# Altium schematic sheet Sensors1-10.SchDoc
size A
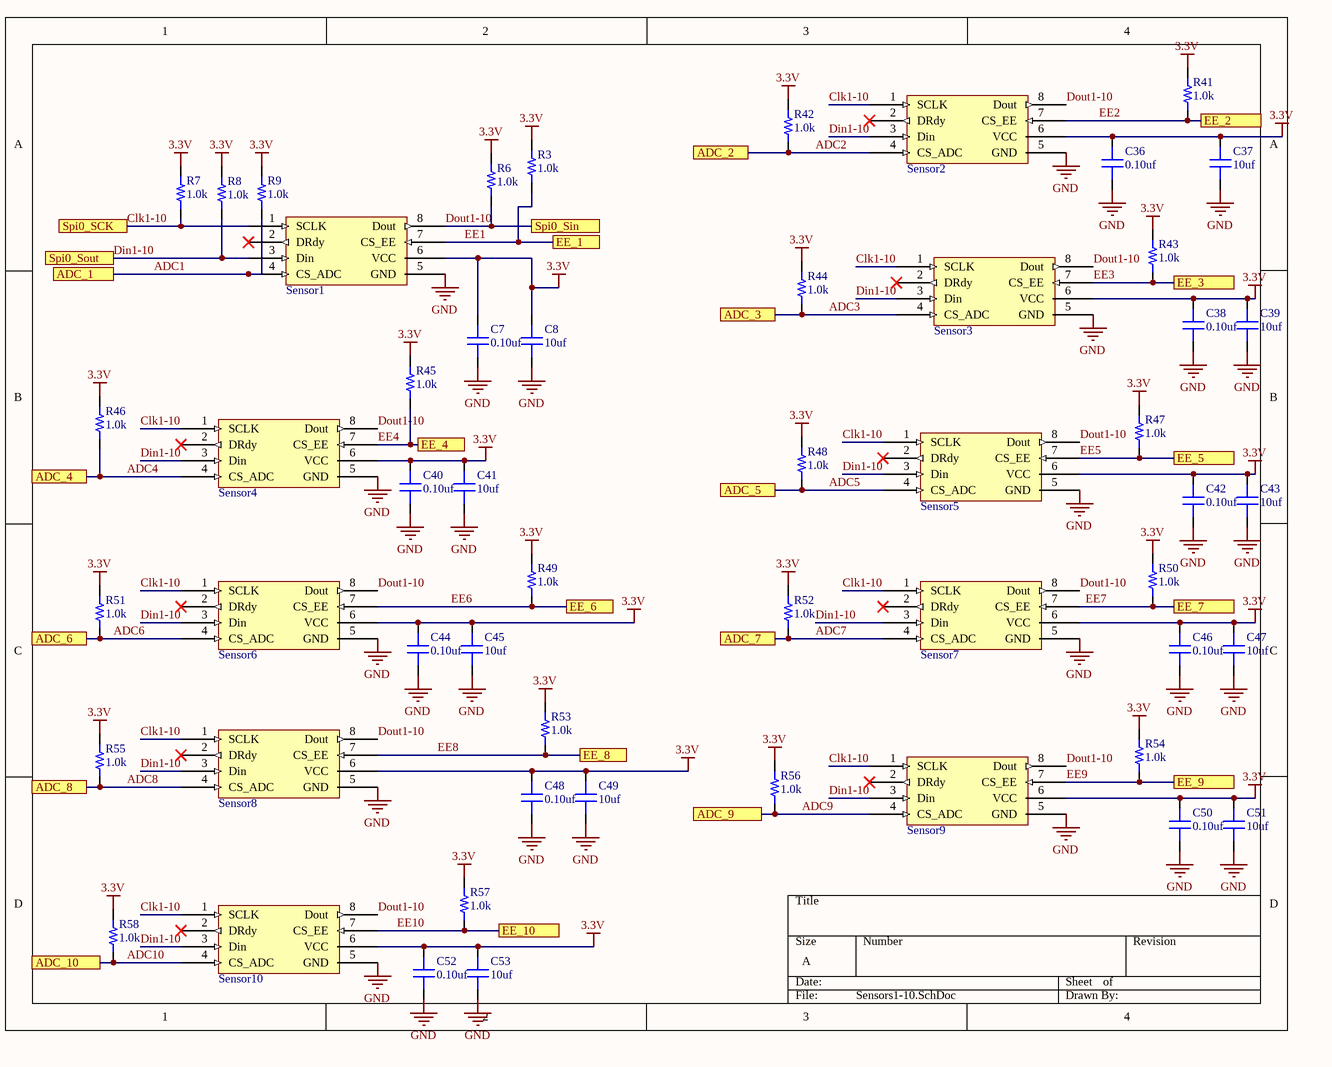
[diagram p0: Sensors1-10.SchDoc]

## Parts
C7  value 0.10uf  [CAP 0603/1608]  (hidden comment: Capacitor MLCC 0.10uf 16V CAP 0603/1608)
C8  value 10uf  [CAP 0603/1608]  (hidden comment: Capacitor MLCC 10uf 16V CAP 0603/1608)
C36  value 0.10uf  [CAP 0603/1608]  (hidden comment: Capacitor MLCC 0.10uf 16V CAP 0603/1608)
C37  value 10uf  [CAP 0603/1608]  (hidden comment: Capacitor MLCC 10uf 16V CAP 0603/1608)
C38  value 0.10uf  [CAP 0603/1608]  (hidden comment: Capacitor MLCC 0.10uf 16V CAP 0603/1608)
C39  value 10uf  [CAP 0603/1608]  (hidden comment: Capacitor MLCC 10uf 16V CAP 0603/1608)
C40  value 0.10uf  [CAP 0603/1608]  (hidden comment: Capacitor MLCC 0.10uf 16V CAP 0603/1608)
C41  value 10uf  [CAP 0603/1608]  (hidden comment: Capacitor MLCC 10uf 16V CAP 0603/1608)
C42  value 0.10uf  [CAP 0603/1608]  (hidden comment: Capacitor MLCC 0.10uf 16V CAP 0603/1608)
C43  value 10uf  [CAP 0603/1608]  (hidden comment: Capacitor MLCC 10uf 16V CAP 0603/1608)
C44  value 0.10uf  [CAP 0603/1608]  (hidden comment: Capacitor MLCC 0.10uf 16V CAP 0603/1608)
C45  value 10uf  [CAP 0603/1608]  (hidden comment: Capacitor MLCC 10uf 16V CAP 0603/1608)
C46  value 0.10uf  [CAP 0603/1608]  (hidden comment: Capacitor MLCC 0.10uf 16V CAP 0603/1608)
C47  value 10uf  [CAP 0603/1608]  (hidden comment: Capacitor MLCC 10uf 16V CAP 0603/1608)
C48  value 0.10uf  [CAP 0603/1608]  (hidden comment: Capacitor MLCC 0.10uf 16V CAP 0603/1608)
C49  value 10uf  [CAP 0603/1608]  (hidden comment: Capacitor MLCC 10uf 16V CAP 0603/1608)
C50  value 0.10uf  [CAP 0603/1608]  (hidden comment: Capacitor MLCC 0.10uf 16V CAP 0603/1608)
C51  value 10uf  [CAP 0603/1608]  (hidden comment: Capacitor MLCC 10uf 16V CAP 0603/1608)
C52  value 0.10uf  [CAP 0603/1608]  (hidden comment: Capacitor MLCC 0.10uf 16V CAP 0603/1608)
C53  value 10uf  [CAP 0603/1608]  (hidden comment: Capacitor MLCC 10uf 16V CAP 0603/1608)
R3  value 1.0k  [RES 0603/1608]  (hidden comment: Resistor 1.0k 0603 1/10W 5%)
R6  value 1.0k  [RES 0603/1608]  (hidden comment: Resistor 1.0k 0603 1/10W 5%)
R7  value 1.0k  [RES 0603/1608]  (hidden comment: Resistor 1.0k 0603 1/10W 5%)
R8  value 1.0k  [RES 0603/1608]  (hidden comment: Resistor 1.0k 0603 1/10W 5%)
R9  value 1.0k  [RES 0603/1608]  (hidden comment: Resistor 1.0k 0603 1/10W 5%)
R41  value 1.0k  [RES 0603/1608]  (hidden comment: Resistor 1.0k 0603 1/10W 5%)
R42  value 1.0k  [RES 0603/1608]  (hidden comment: Resistor 1.0k 0603 1/10W 5%)
R43  value 1.0k  [RES 0603/1608]  (hidden comment: Resistor 1.0k 0603 1/10W 5%)
R44  value 1.0k  [RES 0603/1608]  (hidden comment: Resistor 1.0k 0603 1/10W 5%)
R45  value 1.0k  [RES 0603/1608]  (hidden comment: Resistor 1.0k 0603 1/10W 5%)
R46  value 1.0k  [RES 0603/1608]  (hidden comment: Resistor 1.0k 0603 1/10W 5%)
R47  value 1.0k  [RES 0603/1608]  (hidden comment: Resistor 1.0k 0603 1/10W 5%)
R48  value 1.0k  [RES 0603/1608]  (hidden comment: Resistor 1.0k 0603 1/10W 5%)
R49  value 1.0k  [RES 0603/1608]  (hidden comment: Resistor 1.0k 0603 1/10W 5%)
R50  value 1.0k  [RES 0603/1608]  (hidden comment: Resistor 1.0k 0603 1/10W 5%)
R51  value 1.0k  [RES 0603/1608]  (hidden comment: Resistor 1.0k 0603 1/10W 5%)
R52  value 1.0k  [RES 0603/1608]  (hidden comment: Resistor 1.0k 0603 1/10W 5%)
R53  value 1.0k  [RES 0603/1608]  (hidden comment: Resistor 1.0k 0603 1/10W 5%)
R54  value 1.0k  [RES 0603/1608]  (hidden comment: Resistor 1.0k 0603 1/10W 5%)
R55  value 1.0k  [RES 0603/1608]  (hidden comment: Resistor 1.0k 0603 1/10W 5%)
R56  value 1.0k  [RES 0603/1608]  (hidden comment: Resistor 1.0k 0603 1/10W 5%)
R57  value 1.0k  [RES 0603/1608]  (hidden comment: Resistor 1.0k 0603 1/10W 5%)
R58  value 1.0k  [RES 0603/1608]  (hidden comment: Resistor 1.0k 0603 1/10W 5%)
Sensor1  for Aero Pressure Sensor Board  [RSCMJJM005NDSE3 Pressure Sensor]  (value not drawn)
Sensor2  for Aero Pressure Sensor Board  [RSCMJJM005NDSE3 Pressure Sensor]  (value not drawn)
Sensor3  for Aero Pressure Sensor Board  [RSCMJJM005NDSE3 Pressure Sensor]  (value not drawn)
Sensor4  for Aero Pressure Sensor Board  [RSCMJJM005NDSE3 Pressure Sensor]  (value not drawn)
Sensor5  for Aero Pressure Sensor Board  [RSCMJJM005NDSE3 Pressure Sensor]  (value not drawn)
Sensor6  for Aero Pressure Sensor Board  [RSCMJJM005NDSE3 Pressure Sensor]  (value not drawn)
Sensor7  for Aero Pressure Sensor Board  [RSCMJJM005NDSE3 Pressure Sensor]  (value not drawn)
Sensor8  for Aero Pressure Sensor Board  [RSCMJJM005NDSE3 Pressure Sensor]  (value not drawn)
Sensor9  for Aero Pressure Sensor Board  [RSCMJJM005NDSE3 Pressure Sensor]  (value not drawn)
Sensor10  for Aero Pressure Sensor Board  [RSCMJJM005NDSE3 Pressure Sensor]  (value not drawn)

## Ports
ADC_1, ADC_2, ADC_3, ADC_4, ADC_5, ADC_6, ADC_7, ADC_8, ADC_9, ADC_10, EE_1, EE_2, EE_3, EE_4, EE_5, EE_6, EE_7, EE_8, EE_9, EE_10, Spi0_SCK, Spi0_Sin, Spi0_Sout

## Nets
3.3V: C7.2 C8.2 C36.2 C37.2 C38.2 C39.2 C40.2 C41.2 C42.2 C43.2 C44.2 C45.2 C46.2 C47.2 C48.2 C49.2 C50.2 C51.2 C52.2 C53.2 R3.2 R6.2 R7.2 R8.2 R9.2 R41.2 R42.2 R43.2 R44.2 R45.2 R46.2 R47.2 R48.2 R49.2 R50.2 R51.2 R52.2 R53.2 R54.2 R55.2 R56.2 R57.2 R58.2 Sensor1.6(VCC) Sensor2.6(VCC) Sensor3.6(VCC) Sensor4.6(VCC) Sensor5.6(VCC) Sensor6.6(VCC) Sensor7.6(VCC) Sensor8.6(VCC) Sensor9.6(VCC) Sensor10.6(VCC)
GND: C7.1 C8.1 C36.1 C37.1 C38.1 C39.1 C40.1 C41.1 C42.1 C43.1 C44.1 C45.1 C46.1 C47.1 C48.1 C49.1 C50.1 C51.1 C52.1 C53.1 Sensor1.5(GND) Sensor2.5(GND) Sensor3.5(GND) Sensor4.5(GND) Sensor5.5(GND) Sensor6.5(GND) Sensor7.5(GND) Sensor8.5(GND) Sensor9.5(GND) Sensor10.5(GND)
ADC1: R9.1 Sensor1.4(CS_ADC) ; port ADC_1
ADC2: R42.1 Sensor2.4(CS_ADC) ; port ADC_2
ADC3: R44.1 Sensor3.4(CS_ADC) ; port ADC_3
ADC4: R46.1 Sensor4.4(CS_ADC) ; port ADC_4
ADC5: R48.1 Sensor5.4(CS_ADC) ; port ADC_5
ADC6: R51.1 Sensor6.4(CS_ADC) ; port ADC_6
ADC7: R52.1 Sensor7.4(CS_ADC) ; port ADC_7
ADC8: R55.1 Sensor8.4(CS_ADC) ; port ADC_8
ADC9: R56.1 Sensor9.4(CS_ADC) ; port ADC_9
ADC10: R58.1 Sensor10.4(CS_ADC) ; port ADC_10
Clk1-10: R7.1 Sensor1.1(SCLK) Sensor2.1(SCLK) Sensor3.1(SCLK) Sensor4.1(SCLK) Sensor5.1(SCLK) Sensor6.1(SCLK) Sensor7.1(SCLK) Sensor8.1(SCLK) Sensor9.1(SCLK) Sensor10.1(SCLK) ; port Spi0_SCK
Din1-10: R8.1 Sensor1.3(Din) Sensor2.3(Din) Sensor3.3(Din) Sensor4.3(Din) Sensor5.3(Din) Sensor6.3(Din) Sensor7.3(Din) Sensor8.3(Din) Sensor9.3(Din) Sensor10.3(Din) ; port Spi0_Sout
Dout1-10: R6.1 Sensor1.8(Dout) Sensor2.8(Dout) Sensor3.8(Dout) Sensor4.8(Dout) Sensor5.8(Dout) Sensor6.8(Dout) Sensor7.8(Dout) Sensor8.8(Dout) Sensor9.8(Dout) Sensor10.8(Dout) ; port Spi0_Sin
EE1: R3.1 Sensor1.7(CS_EE) ; port EE_1
EE2: R41.1 Sensor2.7(CS_EE) ; port EE_2
EE3: R43.1 Sensor3.7(CS_EE) ; port EE_3
EE4: R45.1 Sensor4.7(CS_EE) ; port EE_4
EE5: R47.1 Sensor5.7(CS_EE) ; port EE_5
EE6: R49.1 Sensor6.7(CS_EE) ; port EE_6
EE7: R50.1 Sensor7.7(CS_EE) ; port EE_7
EE8: R53.1 Sensor8.7(CS_EE) ; port EE_8
EE9: R54.1 Sensor9.7(CS_EE) ; port EE_9
EE10: R57.1 Sensor10.7(CS_EE) ; port EE_10

Not connected (* = marked no-connect by the designer): Sensor1 2(DRdy)*; Sensor2 2(DRdy)*; Sensor3 2(DRdy)*; Sensor4 2(DRdy)*; Sensor5 2(DRdy)*; Sensor6 2(DRdy)*; Sensor7 2(DRdy)*; Sensor8 2(DRdy)*; Sensor9 2(DRdy)*; Sensor10 2(DRdy)*

## Library data of the parts
C7 C36 C38 C40 C42 C44 C46 C48 C50 C52 = 223: Manufacturer_id: 1; idCapacitor: 223; Name: Cap_0.10uf_16V_CAP 0603/1608; Dielectric: Ceramic; Created_By: Nick Mah; Drawer_id: 1; Voltage_Rating: 16V; Package: CAP 0603/1608; Created_Date: 10/20/2018
C8 C37 C39 C41 C43 C45 C47 C49 C51 C53 = 235: Manufacturer_id: 1; idCapacitor: 235; Name: Cap_10uf_16V_CAP 0603/1608; Dielectric: Ceramic; Created_By: Nick Mah; Drawer_id: 1; Voltage_Rating: 16V; Package: CAP 0603/1608; Created_Date: 10/20/2018
R3 R6-R9 R41-R58 = 1369: Manufacturer_id: 1; idResistor: 1369; Name: Res_1.0k_0603_1/10W_5%; Created_By: Nick Mah; Supplier 1: Digi-Key; Drawer_id: 1; Tolerance: 5%; Power: 1/10W; Package: 0603; ComponentLink1Description: Datasheet; Created_Date: 2018-10-20
Sensor1-Sensor10 = 27: RSCMJJM005NDSE3 Pressure Sensor; Manufacturer_id: 1; idIC_Misc: 27; Vin(Min): 2.7; Vin(Max): 3.3; Drawer_id: 1; Name: RSCMJJM005NDSE3 Pressure Sensor; Link: https://sensing.honeywell.com/RSCMJJM005NDSE3-amplified-board-mount-pressure-sensors